# Altium schematic sheet SCH_onelayer.SchDoc
size A3; SheetNumber: 1; SheetTotal: 1
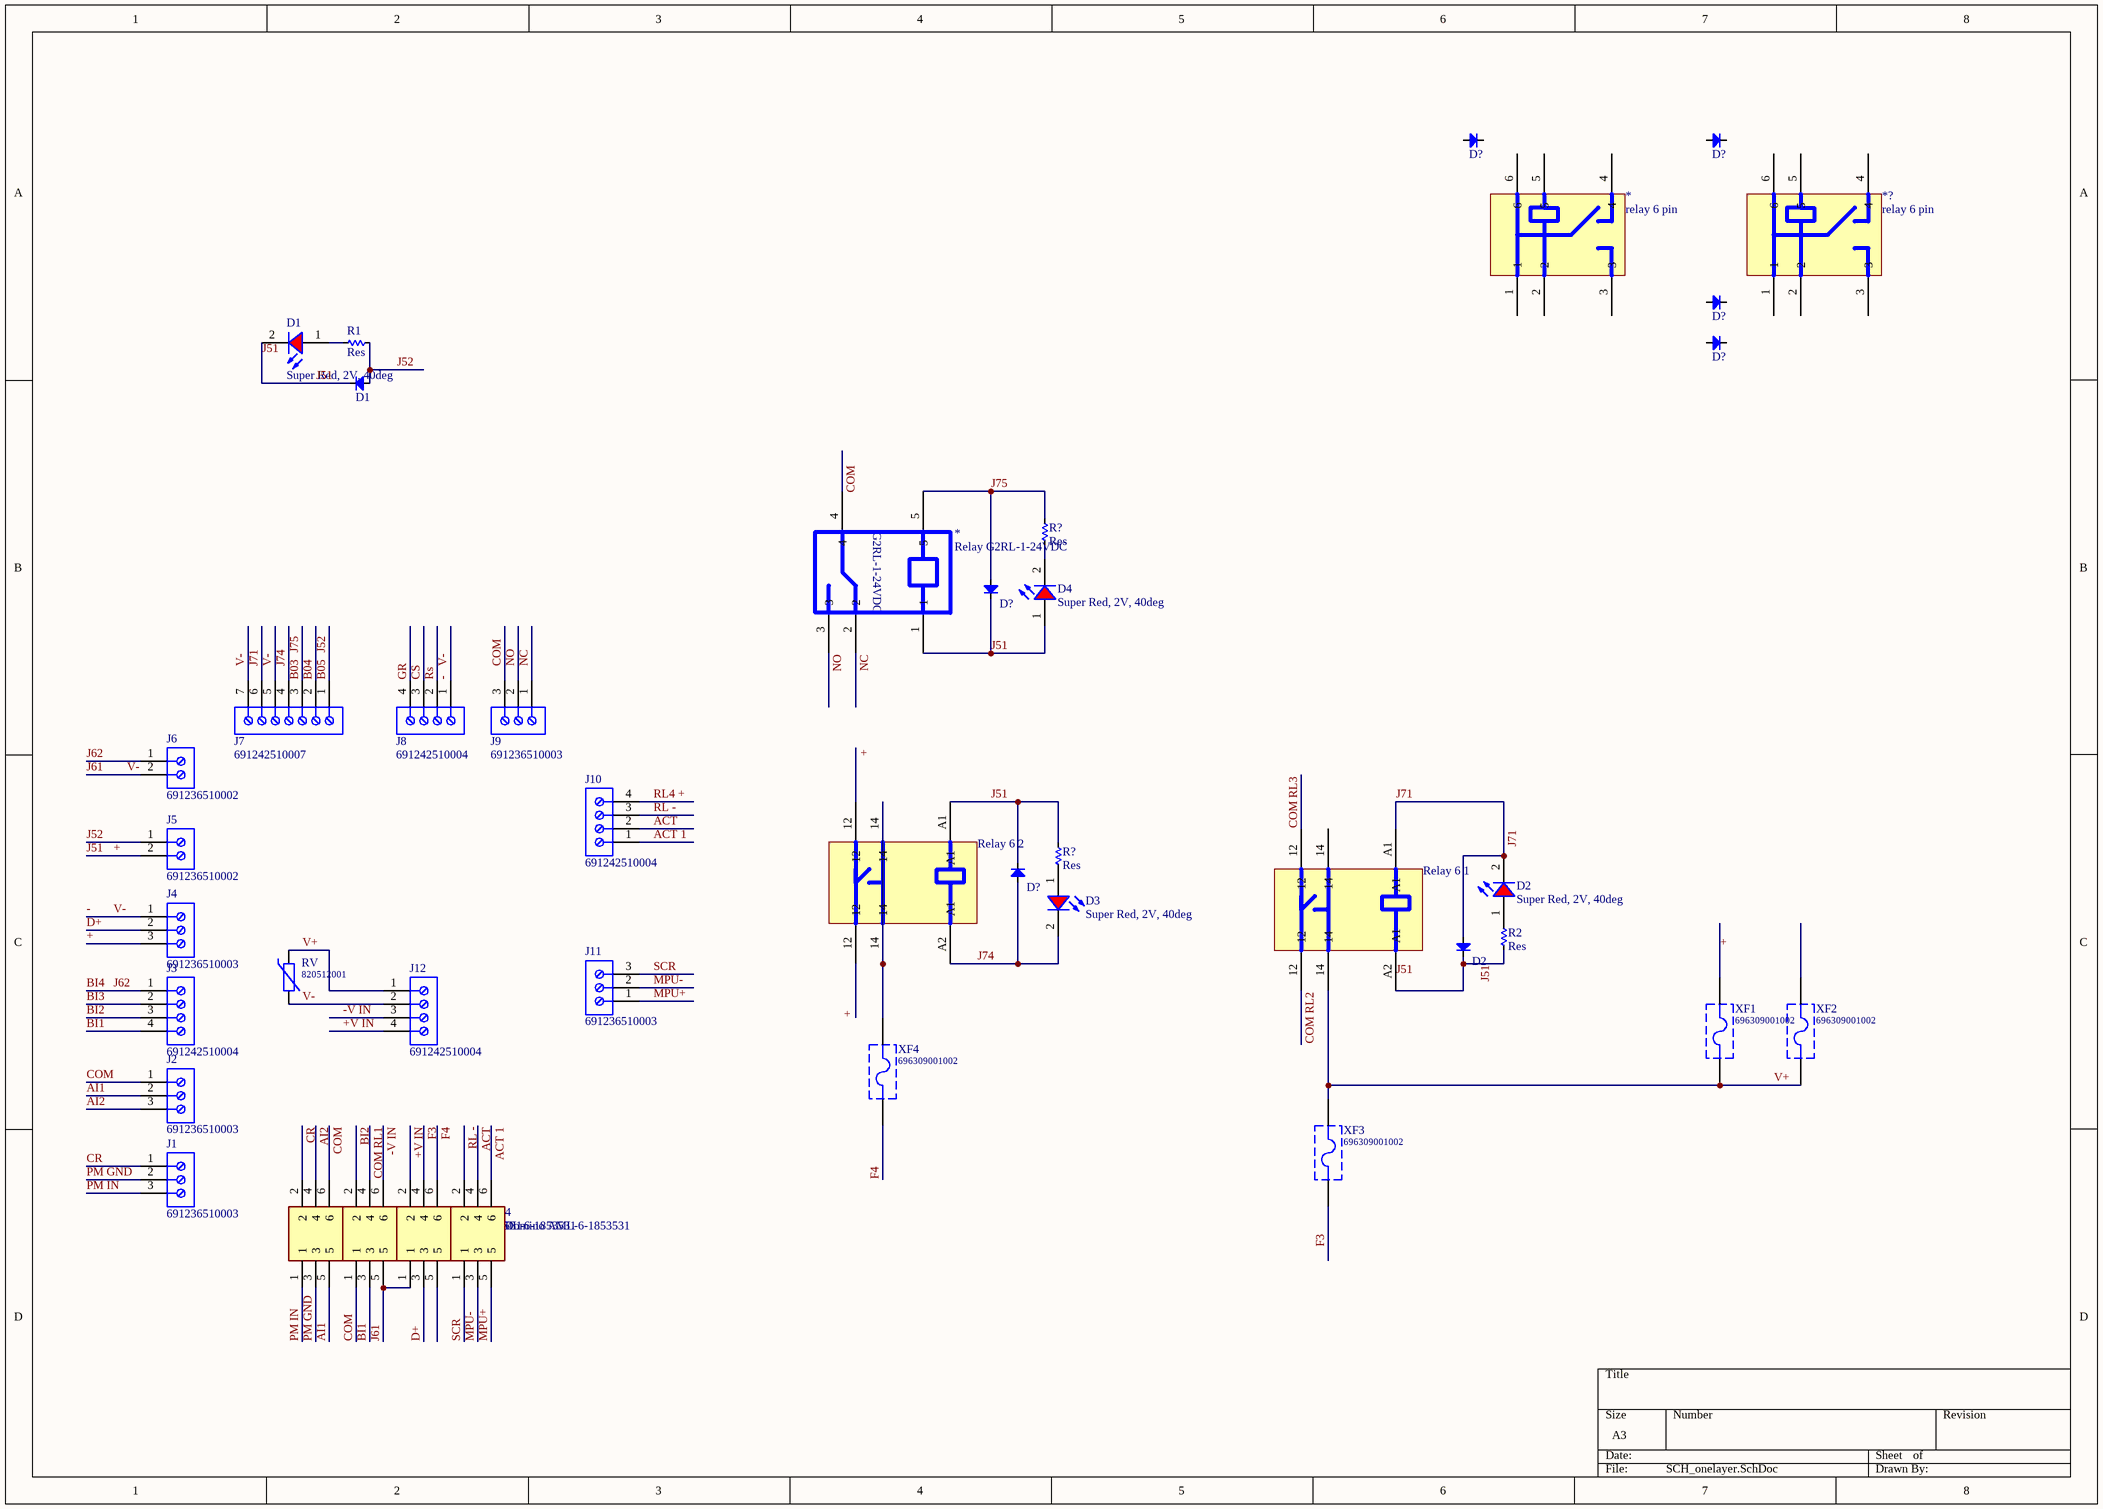
[diagram p0: SCH_onelayer.SchDoc]

## Parts
(Parts that share a designator on the sheet are numbered #1, #2 ... from top to bottom, then left to right.)
1  Domino AML-6-1853531  [AML-6-1853531]
2  Domino AML-6-1853531  [AML-6-1853531]
3  Domino AML-6-1853531  [AML-6-1853531]
4  Domino AML-6-1853531  [AML-6-1853531]
*#1  relay 6 pin  [relay 6 pin]
*#2  Relay G2RL-1-24VDC  [G2RL-1-24VDC]
*?  relay 6 pin  [relay 6 pin]
D1#1  Super Red, 2V, 40deg  [WL-TMRC_3mm]
D1#2  Diode  [DIO-1A]  (value not drawn)
D2#1  Super Red, 2V, 40deg  [WL-TMRC_3mm]
D2#2  Diode  [DIO-1A]  (value not drawn)
D3  Super Red, 2V, 40deg  [WL-TMRC_3mm]
D4  Super Red, 2V, 40deg  [WL-TMRC_3mm]
D?#1  Diode  [DIO-1A]  (value not drawn)
D?#2  Diode  [DIO-1A]  (value not drawn)
D?#3  Diode  [DIO-1A]  (value not drawn)
D?#4  Diode  [DIO-1A]  (value not drawn)
D?#5  Diode  [DIO-1A]  (value not drawn)
D?#6  Diode  [DIO-1A]  (value not drawn)
J1  691236510003  [691236510003]
J2  691236510003  [691236510003]
J3  691242510004  [691242510004]
J4  691236510003  [691236510003]
J5  691236510002  [691236510002]
J6  691236510002  [691236510002]
J7  691242510007  [691242510007]
J8  691242510004  [691242510004]
J9  691236510003  [691236510003]
J10  691242510004  [691242510004]
J11  691236510003  [691236510003]
J12  691242510004  [691242510004]
R1  Res  [RES-1/2W]
R2  Res  [RES-1/2W]
R?#1  Res  [RES-1/2W]
R?#2  Res  [RES-1/2W]
Relay_6_1  (no value)  [Relay 6 pin SMIH-SL-A]
Relay_6_2  (no value)  [Relay 6 pin SMIH-SL-A]
RV  820512001  [D12.5xW5.1xH15.5xP0.8]
XF1  696309001002  [696309001002]
XF2  696309001002  [696309001002]
XF3  696309001002  [696309001002]
XF4  696309001002  [696309001002]

## Nets
+: *#2.1 D1#1.2(K) D1#2.2(K) D2#2.2(K) D4.1(A) D?#5.2(K) D?#6.2(K) J4.3 J5.2 R2.1 R?#2.2 Relay_6_1.A2(A1) Relay_6_2.12 Relay_6_2.A1 XF1.2  [also labelled J51]
+V IN: 3.2 J12.4
-: 2.5 3.1 J4.1 J6.2 J7.5 J7.7 J8.1 J12.2 RV.2  [also labelled J61, V-]
-V IN: 2.6 J12.3
ACT: 4.4 J10.2
ACT 1: 4.6 J10.1
AI1: 1.5 J2.2
AI2: 1.4 J2.3
B03: *#2.5 D?#5.1(A) J7.3 R?#1.1  [also labelled J75]
B04: J7.2
B05: D1#2.1(A) J5.1 J7.1 R1.1  [also labelled J52]
BI1: 2.3 J3.4
BI2: 2.2 J3.3
BI3: J3.2
BI4: J3.1 J6.1  [also labelled J62]
COM: 1.6 2.1 *#2.4 J2.1 J9.3
COM RL1: 2.4
COM RL2: Relay_6_1.12
COM RL3: Relay_6_1.12
CR: 1.2 J1.1
CS: J8.3
D+: 3.3 J4.2
F3: 3.4 XF3.1
F4: 3.6 XF4.1
GR: J8.4
J71: D2#1.2(K) D2#2.1(A) J7.6 Relay_6_1.A1
J74: D3.2(K) D?#6.1(A) J7.4 Relay_6_2.A2(A1)
MPU+: 4.5 J11.1
MPU-: 4.3 J11.2
NC: *#2.2 J9.1
NO: *#2.3 J9.2
PM GND: 1.3 J1.2
PM IN: 1.1 J1.3
RL4 +: J10.4
RL -: 4.2 J10.3
Rs: J8.2
SCR: 4.1 J11.3
V+: J12.1 Relay_6_1.14 RV.1 XF1.1 XF2.1 XF3.2
NetD1#1_1: D1#1.1(A) R1.2
NetD2#1_1: D2#1.1(A) R2.2
NetD3_1: D3.1(A) R?#2.1
NetD4_2: D4.2(K) R?#1.2
NetRelay_6_2_14: Relay_6_2.14 XF4.2

Not connected (* = marked no-connect by the designer): 3 5; *#1 1 2 3 4 5 6; *? 1 2 3 4 5 6; D?#1 1(A) 2(K); D?#2 1(A) 2(K); D?#3 1(A) 2(K); D?#4 1(A) 2(K); XF2 2

## Notes on the sheet
- Labels drawn without touching a wire or pin: J51
- (in symbol Relay G2RL-1-24VDC) G2RL-1-24VDC

## Library data of the parts
D1#1 D2#1 D3 D4 = 151031SS04000: WL-TMRC THT Mono-color Round Color, size 3mm, Super Red, 2V, 40deg; Luminous Intensity: 160mcd; Dominant Wavelength: 635nm; Peak Wavelength: 640nm; Chip Technology: AlInGaP; ComponentLink1Description: Manufacturer; ComponentLink1URL: http://www.we-online.de; ComponentLink2Description: Datasheet; ComponentLink2URL: https://katalog.we-online.de/led/datasheet/151031SS04000.pdf; Emitting Color: Super Red; Operating Temperature: -40 to +85degC; Mounting Technology: THT; Forward Voltage: 2V; Part Number: 151031SS04000; Packaging: Bulk; Published Date: January 2021; Publisher: Wurth Elektronik; Size: 3mm; Viewing Angle: 40deg
D1#2 D2#2 D?#1-D?#6 = Diode: Default Diode; Code - JEDEC: DO-214-AB; Value: 1N5007; Published: 8-Jun-2000; Revision: July-2002: Re-released for DXP Platform.; Publisher: Altium Limited
J1 J2 J4 J9 J11 = 691236510003: WR-TBL Serie 2365 Horizontal Entry, Rising Cage Clamp, THT, pitch 5.08mm, 3p; Manufacturer: Wurth Elektronik; Modularity: Yes; PCB/Cable/Panel: PCB; Pin Number: 3; Rated Current [UL]: 20A; Working Voltage [UL]: 300VAC; ComponentLink1Description: Manufacturer; ComponentLink1URL: http://www.we-online.de; ComponentLink2URL: https://katalog.we-online.de/em/datasheet/691236510003.pdf; ComponentLink2Description: Datasheet; Mounting Technology: THT; Manufacturer Part Number: 691236510003; Packaging: Box; Operating Temperature: -30 to +120degC; Pitch: 5.08mm; Published Date: Feburary 2021; Type: Horizontal; Application: Rising Cage Clamp
J3 J8 J10 J12 = 691242510004: WR-TBL Serie 2425 Horizontal Entry Modular, Rising Cage Clamp, THT, pitch 5.08mm, 4p; Manufacturer: Wurth Elektronik; Modularity: No; PCB/Cable/Panel: PCB; Pin Number: 4; Rated Current [UL]: 14A; Working Voltage [UL]: 300VAC; ComponentLink1Description: Manufacturer; ComponentLink1URL: http://www.we-online.de; ComponentLink2URL: https://katalog.we-online.de/em/datasheet/691242510004.pdf; ComponentLink2Description: Datasheet; Mounting Technology: THT; Manufacturer Part Number: 691242510004; Packaging: Box; Operating Temperature: -30 to +120degC; Pitch: 5.08mm; Published Date: Feburary 2021; Type: Horizontal; Application: Rising Cage Clamp
J5 J6 = 691236510002: WR-TBL Serie 2365 Horizontal Entry, Rising Cage Clamp, THT, pitch 5.08mm, 2p; Manufacturer: Wurth Elektronik; Modularity: Yes; PCB/Cable/Panel: PCB; Pin Number: 2; Rated Current [UL]: 20A; Working Voltage [UL]: 300VAC; ComponentLink1Description: Manufacturer; ComponentLink1URL: http://www.we-online.de; ComponentLink2URL: https://katalog.we-online.de/em/datasheet/691236510002.pdf; ComponentLink2Description: Datasheet; Mounting Technology: THT; Manufacturer Part Number: 691236510002; Packaging: Box; Operating Temperature: -30 to +120degC; Pitch: 5.08mm; Published Date: Feburary 2021; Type: Horizontal; Application: Rising Cage Clamp
J7 = 691242510007: WR-TBL Serie 2425 Horizontal Entry Modular, Rising Cage Clamp, THT, pitch 5.08mm, 7p; Manufacturer: Wurth Elektronik; Modularity: No; PCB/Cable/Panel: PCB; Pin Number: 7; Rated Current [UL]: 14A; Working Voltage [UL]: 300VAC; ComponentLink1Description: Manufacturer; ComponentLink1URL: http://www.we-online.de; ComponentLink2URL: https://katalog.we-online.de/em/datasheet/691242510007.pdf; ComponentLink2Description: Datasheet; Mounting Technology: THT; Manufacturer Part Number: 691242510007; Packaging: Box; Operating Temperature: -30 to +120degC; Pitch: 5.08mm; Published Date: Feburary 2021; Type: Horizontal; Application: Rising Cage Clamp
R1 R2 R?#1 R?#2 = Res: Manufacturer: Generic Components; Class: Passive; SubClass: R; Published: 08/06/2000; Publisher: Altium Hobart Technology Centre
Relay_6_1 Relay_6_2 = Relay DMIH-05/12/24VDC-SL-A songle 16A 6pin
RV = 820512001: WE-VD Disk Varistor, D12.5mm, W5.1mm, H15.5mm, 20VAC, 26VDC; Manufacturer: Wurth Elektronik; (Channel) Input Capacitance: 4250pF; (Reverse) Peak Pulse Current: 500A; (Reverse) Breakdown Voltage: 33V; Clamping Voltage: 65V; AC Operating Voltage: 20V; DC Operating Voltage: 26V; Energy Absorbtion: 4.4J; Power Dissipation: 0.05W; ComponentLink1URL: http://www.we-online.de; ComponentLink2Description: Datasheet; ComponentLink2URL: https://www.we-online.com/catalog/datasheet/820512001.pdf; ComponentLink1Description: Manufacturer; Diameter: 12.5mm; Mounting Technology: THT; Height max.: 15.5mm; Operating Temperature: -40 to +85degC; Packaging: Tape and Reel; Manufacturer Part Number: 820512001; Width max.: 5.1mm; Published Date: April 2020; Width typ.: 3.3mm
XF1-XF4 = 696309001002: WR-FSH Shocksafe Fuse Holder Turn and Lock Cover for PCB; Manufacturer: Wurth Elektronik; Fuse Size: 5x20mm; ComponentLink1Description: Manufacturer; ComponentLink1URL: http://www.we-online.de; ComponentLink2Description: Datasheet; ComponentLink2URL: https://www.we-online.com/catalog/datasheet/696309001002.pdf; Manufacturer Part Number: 696309001002; Published Date: March 2021; Operating Temperature: -30 to +120degC; Mounting Technology: THT; Packaging: Box